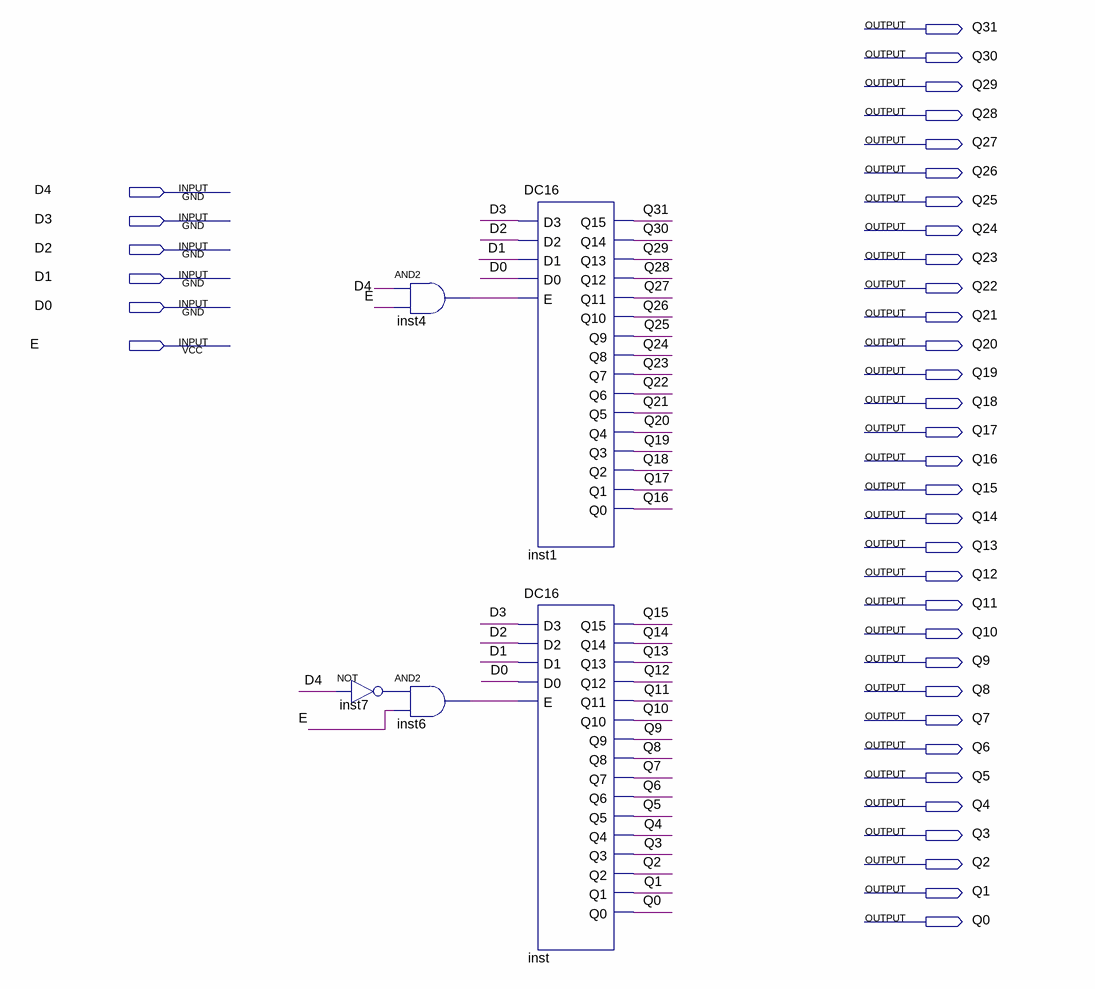
[diagram p0: schematic sheet]
// Quartus schematic DC32.bdf as structural Verilog: 5 symbols, 38 pins
module DC32 (
  input  D4,
  input  D3,
  input  D2,
  input  D1,
  input  D0,
  input  E,
  output Q31,
  output Q30,
  output Q29,
  output Q28,
  output Q27,
  output Q26,
  output Q25,
  output Q24,
  output Q23,
  output Q22,
  output Q21,
  output Q20,
  output Q19,
  output Q18,
  output Q17,
  output Q16,
  output Q15,
  output Q14,
  output Q13,
  output Q12,
  output Q11,
  output Q10,
  output Q9,
  output Q8,
  output Q7,
  output Q6,
  output Q5,
  output Q4,
  output Q3,
  output Q2,
  output Q1,
  output Q0
);

  wire inst4_out, inst6_out, inst7_out;

  and inst4 (inst4_out, D4, E);
  not inst7 (inst7_out, D4);
  and inst6 (inst6_out, inst7_out, E);
  DC16 inst1 (
    .D3(D3), .D2(D2), .D1(D1), .D0(D0), .E(inst4_out), .Q15(Q31), .Q14(Q30), .Q13(Q29), .Q12(Q28), .Q11(Q27),
    .Q10(Q26), .Q9(Q25), .Q8(Q24), .Q7(Q23), .Q6(Q22), .Q5(Q21), .Q4(Q20), .Q3(Q19), .Q2(Q18), .Q1(Q17),
    .Q0(Q16));
  DC16 inst (
    .D3(D3), .D2(D2), .D1(D1), .D0(D0), .E(inst6_out), .Q15(Q15), .Q14(Q14), .Q13(Q13), .Q12(Q12), .Q11(Q11),
    .Q10(Q10), .Q9(Q9), .Q8(Q8), .Q7(Q7), .Q6(Q6), .Q5(Q5), .Q4(Q4), .Q3(Q3), .Q2(Q2), .Q1(Q1), .Q0(Q0));
endmodule
